# EasyEDA schematic SCH_Apple II Game port_rev1.0b.json
TITLE: Apple II+ Game Port; REV: 1.0b; Date: 2023-12-03; Sheet: 1/1; Drawn By: VIBR; Company: Vincent BESSON
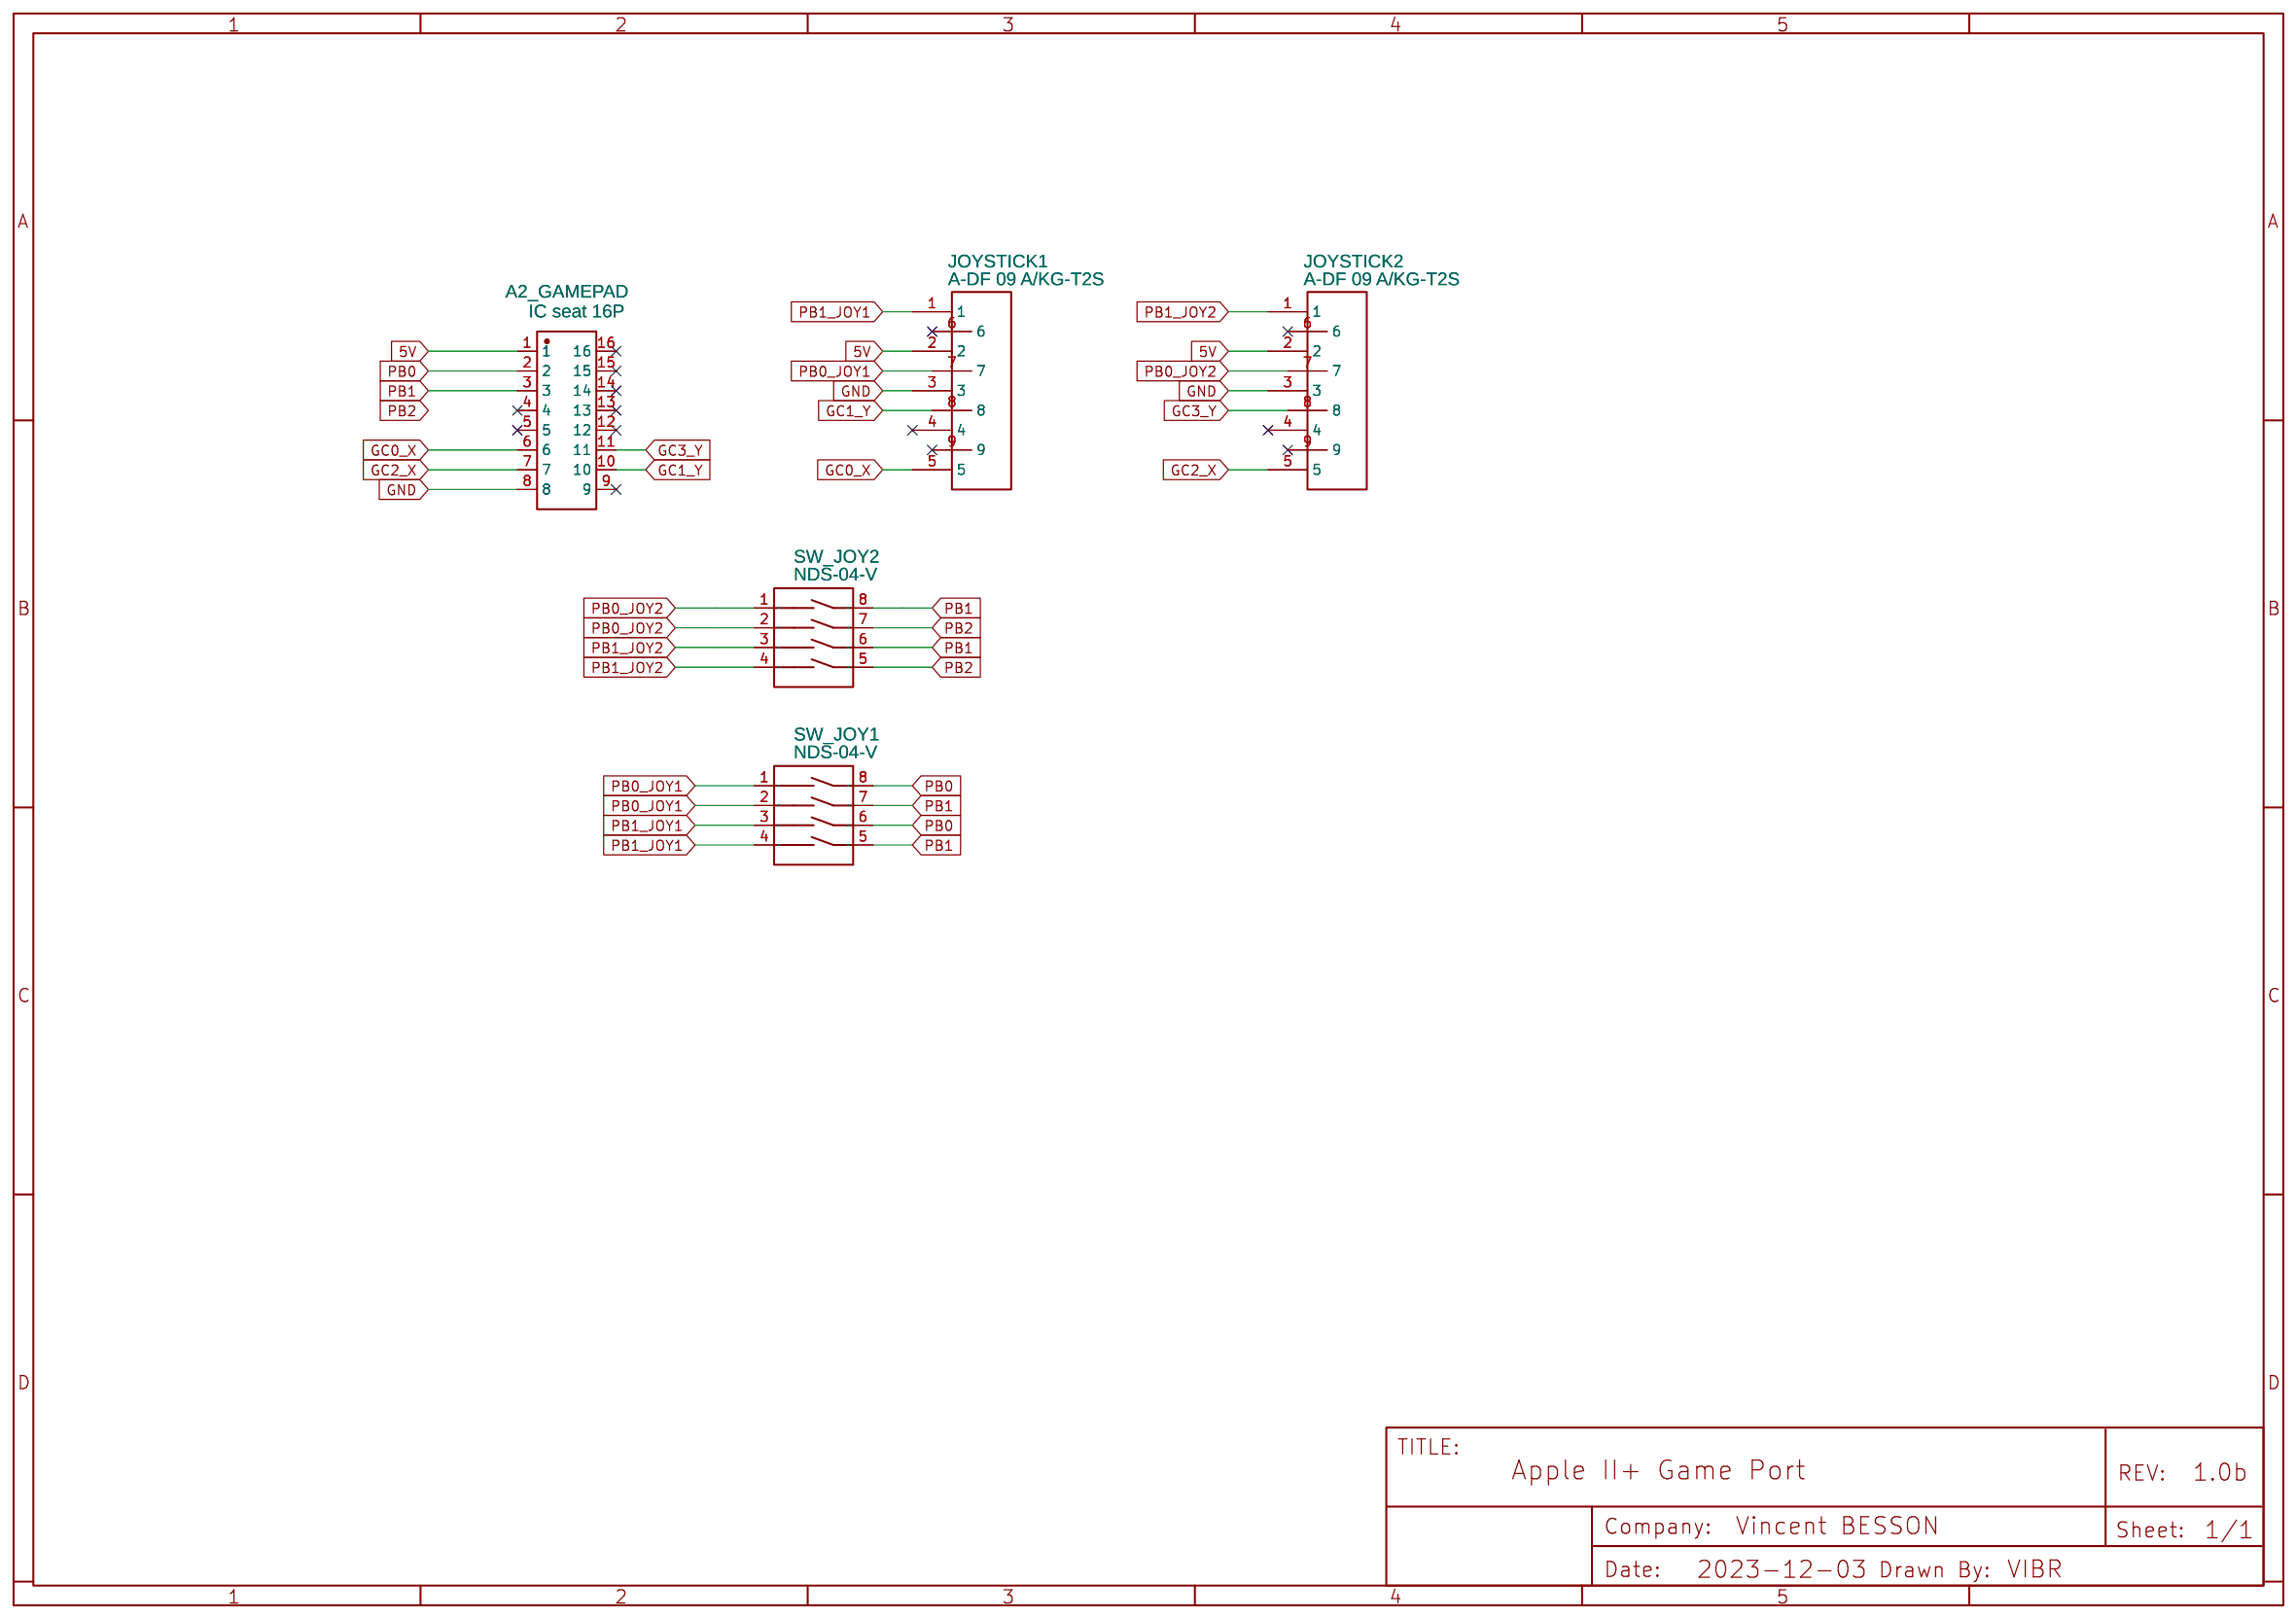
[diagram p0: schematic sheet]

## Parts
A2_GAMEPAD  IC seat 16P  [DIP-16_L20.3-W10.2-P2.54-LS7.6-BL]
JOYSTICK1  A-DF 09 A/KG-T2S  [A-DF 09 A/KG-T2S]
JOYSTICK2  A-DF 09 A/KG-T2S  [A-DF 09 A/KG-T2S]
SW_JOY1  NDS-04-V  [SW-TH_8P-L11.8-W9.9-P2.54-LS7.6]
SW_JOY2  NDS-04-V  [SW-TH_8P-L11.8-W9.9-P2.54-LS7.6]

## Library data of the parts
A2_GAMEPAD = IC seat 16P: Contributor: LCSC; Supplier: LCSC; Supplier Part: C2326; Manufacturer: BOOMELE(博穆精密); Manufacturer Part: IC-16P窄; JLCPCB Part Class: Extended Part; link: https://lcsc.com/eda_search?q=C2326&%26type=1&ref=editor
JOYSTICK1 JOYSTICK2 = A-DF 09 A/KG-T2S: Supplier: Digi-Key; Supplier Part: AE10921-ND; Contributor: stanisjw
SW_JOY1 SW_JOY2 = NDS-04-V: Supplier: LCSC; Manufacturer: DIP; Supplier Part: C113482; JLCPCB Part Class: Extended Part; link: https://lcsc.com/eda_search?q=C113482&%26type=1&ref=editor

## Nets
5V: A2_GAMEPAD.1 JOYSTICK1.2 JOYSTICK2.2
GND: A2_GAMEPAD.8 JOYSTICK1.3 JOYSTICK2.3
GC0_X: A2_GAMEPAD.6 JOYSTICK1.5
GC1_Y: A2_GAMEPAD.10 JOYSTICK1.8
GC2_X: A2_GAMEPAD.7 JOYSTICK2.5
GC3_Y: A2_GAMEPAD.11 JOYSTICK2.8
PB0: A2_GAMEPAD.2 SW_JOY1.6 SW_JOY1.8
PB0_JOY1: JOYSTICK1.7 SW_JOY1.1 SW_JOY1.2
PB0_JOY2: JOYSTICK2.7 SW_JOY2.1 SW_JOY2.2
PB1: A2_GAMEPAD.3 SW_JOY1.5 SW_JOY1.7 SW_JOY2.6 SW_JOY2.8
PB1_JOY1: JOYSTICK1.1 SW_JOY1.3 SW_JOY1.4
PB1_JOY2: JOYSTICK2.1 SW_JOY2.3 SW_JOY2.4
PB2: SW_JOY2.5 SW_JOY2.7

Not connected (* = marked no-connect by the designer): A2_GAMEPAD 4* 5* 9* 12* 13* 14* 15* 16*; JOYSTICK1 4* 6* 9*; JOYSTICK2 4* 6* 9*
